# EAGLE design Funky_v3_r3 (EAGLE 6.1)
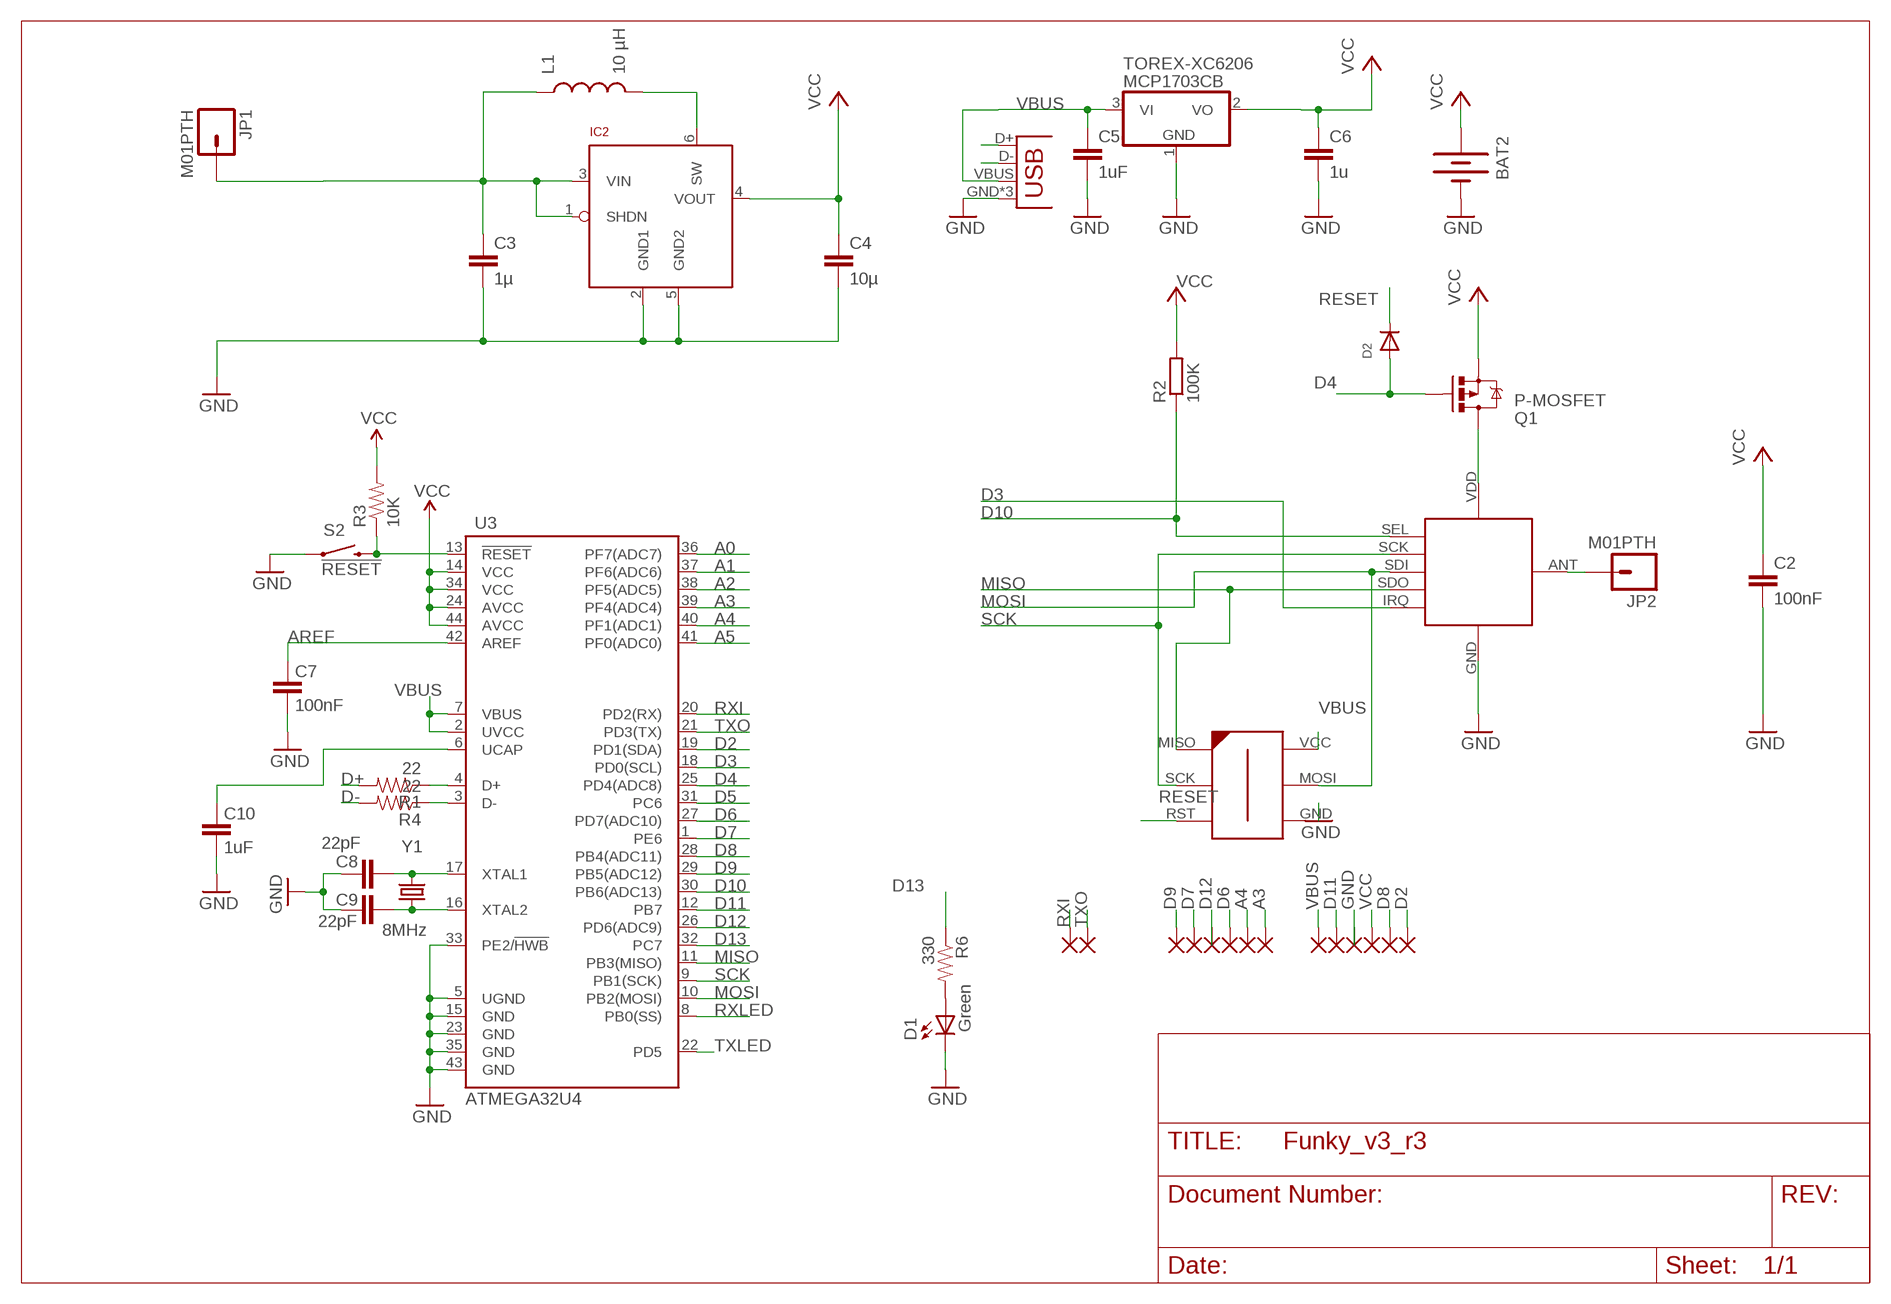
[diagram p0: schematic, sheet 1]

## Parts
BAT2  BATTERY20PTH  [BATTCOM_20MM_PTH]
C2  100nF  C-EUC0603K  [C0603K]
C3  1µ  CAP0603-CAP  [0603-CAP]
C4  10µ  CAP0805  [0805]
C5  1uF  C-EUC0603K  [C0603K]
C6  1u  C-EUC0603K  [C0603K]
C7  100nF  CAP0402-CAP  [0402-CAP]
C8  22pF  CAP0402-CAP  [0402-CAP]
C9  22pF  CAP0402-CAP  [0402-CAP]
C10  1uF  CAP0402-CAP  [0402-CAP]
D1  Green  LED0603  [LED-0603]
D2  DIODESOD-323F  [SOD-323F]
IC2  LTC3525  [SC70]
JP1  M01PTH  [1X01]
JP2  M01PTH  [1X01]
JP3  USB-MICROB  [USB-MICROB]
L1  10 µH  INDUCTOR1210  [1210]
PAD1  SMD2  [SMD1,27-2,54]
PAD2  SMD2  [SMD1,27-2,54]
PAD3  SMD2  [SMD1,27-2,54]
PAD4  SMD2  [SMD1,27-2,54]
PAD5  SMD2  [SMD1,27-2,54]
PAD6  SMD2  [SMD1,27-2,54]
PAD7  SMD2  [SMD1,27-2,54]
PAD8  SMD2  [SMD1,27-2,54]
PAD9  SMD2  [SMD1,27-2,54]
PAD10  SMD2  [SMD1,27-2,54]
PAD11  SMD2  [SMD1,27-2,54]
PAD12  SMD2  [SMD1,27-2,54]
PAD13  SMD2  [SMD1,27-2,54]
PAD14  SMD2  [SMD1,27-2,54]
Q1  P-MOSFET  MOSFET-PCHANNEL  [SOT23]
R1  22  RESISTOR0402-RES  [0402-RES]
R2  100K  R-EU_R0402  [R0402]
R3  10K  RESISTOR0402-RES  [0402-RES]
R4  22  RESISTOR0402-RES  [0402-RES]
R6  330  RESISTOR0402-RES  [0402-RES]
RFM12B1  RFM12B_MINPADS  [RFM12B-MINPADS]
S2  !RESET  SWITCH-MOMENTARY-2SMD  [TACTILE_SWITCH_SMD]
TOREX-XC6206  MCP1703CB  [SOT23]
U3  ATMEGA32U4  ATMEGA32U4QFN2  [QFN-44-NOPAD]
U$2  AVR-ISP-6-EDGE  [6PAD_ISP]
Y1  8MHz  CRYSTAL5X3  [CRYSTAL-SMD-5X3]

## Nets
A0: U3.36(PF7(ADC7))
A1: U3.37(PF6(ADC6))
A2: U3.38(PF5(ADC5))
A3: PAD6.1(P) U3.39(PF4(ADC4))
A4: PAD5.1(P) U3.40(PF1(ADC1))
A5: U3.41(PF0(ADC0))
AREF: C7.2 U3.42(AREF)
D2: PAD12.1(P) U3.19(PD1(SDA))
D3: RFM12B1.IRQ U3.18(PD0(SCL))
D4: D2.A Q1.1(G) U3.25(PD4(ADC8))
D5: U3.31(PC6)
D6: PAD4.1(P) U3.27(PD7(ADC10))
D7: PAD2.1(P) U3.1(PE6)
D8: PAD11.1(P) U3.28(PB4(ADC11))
D9: PAD1.1(P) U3.29(PB5(ADC12))
D10: R2.1 RFM12B1.SEL U3.30(PB6(ADC13))
D11: PAD7.1(P) U3.12(PB7)
D12: PAD3.1(P) U3.26(PD6(ADC9))
D13: R6.1 U3.32(PC7)
D+: JP3.D+ R1.2
D-: JP3.D- R4.2
GND [power]: BAT2.2(-) C2.2 C3.2 C4.2 C5.2 C6.2 C7.1 C8.2 C9.2 C10.1 D1.C IC2.2(GND1) IC2.5(GND2) JP3.GND JP3.MT1(GND) JP3.MT2(GND) PAD9.1(P) RFM12B1.GND S2.1 TOREX-XC6206.1(GND) U3.5(UGND) U3.15(GND) U3.23(GND) U3.33(PE2/!HWB) U3.35(GND) U3.43(GND) U$2.GND
MISO: RFM12B1.SDO(SDO/MISO) U3.11(PB3(MISO)) U$2.MISO
MOSI: RFM12B1.SDI(SDI/MOSI) U3.10(PB2(MOSI)) U$2.MOSI
N$1: C9.1 U3.16(XTAL2) Y1.1
N$2: R1.1 U3.4(D+)
N$3: JP2.1 RFM12B1.ANT
N$4: C8.1 U3.17(XTAL1) Y1.3
N$5: C10.2 U3.6(UCAP)
N$6: D1.A R6.2
N$7: R4.1 U3.3(D-)
N$10: Q1.3(D) RFM12B1.VDD
N$13 [power]: IC2.6(SW) L1.2
RESET: D2.C R3.1 S2.3 U3.13(!RESET) U$2.RST
RXI: PAD14.1(P) U3.20(PD2(RX))
RXLED: U3.8(PB0(SS))
SCK: RFM12B1.SCK U3.9(PB1(SCK)) U$2.SCK
TXLED: U3.22(PD5)
TXO: PAD13.1(P) U3.21(PD3(TX))
VBUS [power]: C5.1 JP3.VBUS PAD8.1(P) TOREX-XC6206.3(VI) U3.2(UVCC) U3.7(VBUS) U$2.VCC
VCC [power]: BAT2.1(+) C2.1 C4.1 C6.1 IC2.4(VOUT) PAD10.1(P) Q1.2(S) R2.2 R3.2 TOREX-XC6206.2(VO) U3.14(VCC) U3.24(AVCC) U3.34(VCC) U3.44(AVCC)
VIN [power]: C3.1 IC2.1(SHDN) IC2.3(VIN) JP1.1 L1.1

## Library data of the parts
BAT2 = SparkFun:BATTERY: Battery Holders Various common sizes : AA, AAA, 20mm coin cell and 12mm coin cell.
C2 C5 C6 = rcl:C-EU: CAPACITOR, European symbol
C3 C4 C7-C10 = SparkFun:CAP: Capacitor Standard 0603 ceramic capacitor, and 0.1" leaded capacitor.
D1 = SparkFun:LED: LEDs Standard schematic elements and footprints for 5mm, 3mm, 1206, and 0603 sized LEDs. 5mm - Spark Fun Electronics SKU : COM-00529 (and others)
D2 = adafruit:DIODE: Diode SMADIODE - SMA Surface Mount Package 20V 1A Schottky Diode Digikey: 641-1014-6-ND DO-1N4148 - Through Hole Small Current Diode SOD-123 20V 1 A (.5mV Vf) Schottky Diode - Digikey: MBRX120TPMSCT-ND SOD-323 10V 570mA (.38mV Vf, 3ns) Schottky Diode - Digikey: ZLLS410CT-ND SOD-523 30V 30mA Schottky Diode (RB751S-40TE61) - Digikey: RB751S-40TE61CT-ND SOT23-R/W - SOT23 Package (R = Solder Paste/Reflow Ovens, W = Hand-Soldering) BAT54Film 40V 300mA - Digikey: 497-7162-1-ND
IC2 = JeeLabs:LTC3525
JP1 JP2 = SparkFun:M01: Header 1 Standard 1-pin 0.1" header. Use with straight break away headers (SKU : PRT-00116), right angle break away headers (PRT-00553), swiss pins (PRT-00743), machine pins (PRT-00117), and female headers (PRT-00115).
JP3 = SparkFun-Connectors:USB: USB Connectors USB-B-PTH is fully proven SKU : PRT-00139/CONN-08278 USB-miniB is fully proven SKU : PRT-00587 USB-A-PCB is untested. USB-A-H is throughly reviewed, but untested. Spark Fun Electronics SKU : PRT-00437 USB-B-SMT is throughly reviewed, but untested. Needs silkscreen touching up. USB-A-S has not been used/tested USB-MB-H has not been used/tested USB-MICROB has been used. CONN-09505; PROD_ID: CONN-09505
L1 = SparkFun:INDUCTOR: Inductors Basic Inductor/Choke - 0603 and 1206. Footprints are not proven and vary greatly between part numbers.
PAD1-PAD14 = wirepad:SMD2: SMD PAD
Q1 = SparkFun:MOSFET-PCHANNEL
R1 R3 R4 R6 = SparkFun:RESISTOR: Resistor Basic schematic elements and footprints for 0603, 1206, and PTH resistors.
R2 = resistor:R-EU_: RESISTOR, European symbol
RFM12B1 = LowPowerLab:RFM12B_MINPADS
S2 = SparkFun-Electromechanical:SWITCH-MOMENTARY-2: Various NO switches- pushbuttons, reed, etc; PROD_ID: SWCH-08247
TOREX-XC6206 = linear:MCP1703: 250 mA, 16V, Low Quiescent Current LDO Regulator Source: http://ww1.microchip.com/downloads/en/DeviceDoc/22049b.pdf
U3 = SparkFun:ATMEGA32U4
U$2 = avr-7:AVR-ISP-6-EDGE: 6 pin edge connector for ISP with ATMEL MCUs. Developed by Craig Moates (craig at moates dot net). Library by David Blundell (blundar at gmail dot com). Often, even a 6 pin header is really inconvenient for board layout and/or production. This SMD-only header is our de-facto standard for using an edge connector for programming with the help of a 6pin/10pin to edge card adapter.
Y1 = SparkFun:CRYSTAL: Crystals Various standard crystals. Proven footprints. Spark Fun Electronics SKU : COM-00534

## Net classes
1 power: width 0.254 mm, clearance 0.203 mm

## Board
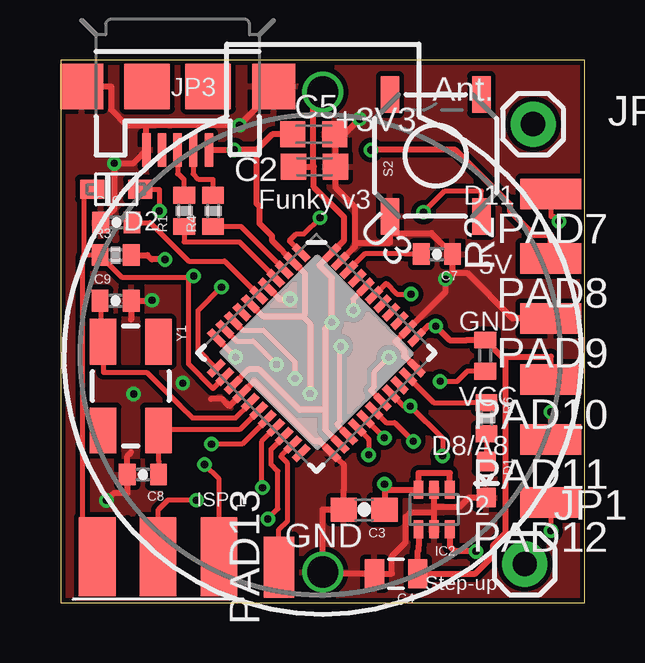
[diagram p1: board, top side]
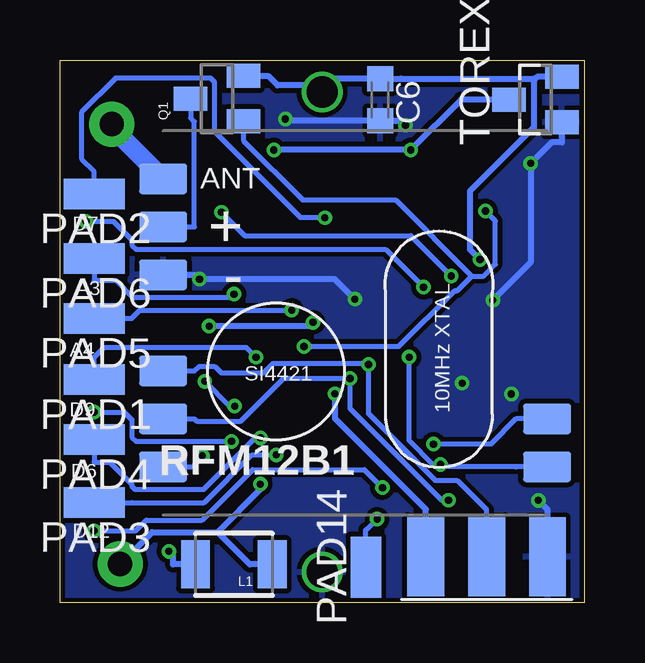
[diagram p2: board, bottom side, seen from below]

Size 21.84 x 22.61 mm. Coordinates in mm from the lower left corner, seen from the top.
Outline: 0,0 21.84,0 21.84,22.61 0,22.61 0,0
Copper layers (1*16): Top 0.035mm / dielectric 1.5mm / Bottom 0.035mm
Design rules: minimum track width 0.2mm, minimum drill 0.3mm, track to track 0.2mm, track to pad 0.2mm, pad to pad 0.2mm, via to via 0.2mm, smd to smd 0.2mm, copper to edge 0.2mm, drill to drill 0.2mm, minimum pad ring 0.2mm, minimum via ring 0.15mm, stop-mask expansion 0.075mm, vias tented up to drill 0.3mm, thermal gap 0.2mm
tRestrict: 2 lines
bRestrict: 2 lines

### Footprints (pad centres in the part's own frame; a part is rotated, then mirrored left to right if it is on the bottom)
BATTCOM_20MM_PTH = drill 1.3: 1 20,0; 2 0,0
C0603K = smd 1.05 x 1.08: 1 -0.875,0; 2 0.875,0
0603-CAP = smd 1.1 x 1: 1 -0.85,0; 2 0.85,0
0805 = smd 0.8 x 1.2: 1 -0.9,0; 2 0.9,0
0402-CAP = smd 0.7 x 0.9: 1 -0.65,0; 2 0.65,0
LED-0603 = smd 0.8 x 0.8: A 0,-0.75; C 0,0.75
SOD-323F = smd 1 x 0.8: A -1,0; C 1,0
SC70 = smd 0.4 x 0.75: 1 -0.65,-0.825; 2 0,-0.825; 3 0.65,-0.825; 4 0.65,0.825; 5 0,0.825; 6 -0.65,0.825
1X01 = drill 1.016 pad 1.88: 1 0,0
USB-MICROB = smd 0.35 x 1.4: D+ 0,2.65; D- -0.65,2.65; GND 1.3,2.65; ID 0.65,2.65; VBUS -1.3,2.65 | smd 1.8 x 1.9: MT1 -4,0; MT2 4,0 | smd 1.9 x 1.9: P$1 -1.27,0; P$2 1.27,0
1210 = smd 1.2 x 2: 1 -1.6,0; 2 1.6,0
SMD1,27-2,54 = smd 1.27 x 2.54: 1 0,0
SOT23 = smd 1 x 1.4: 1 -0.95,-1.1; 2 0.95,-1.1; 3 0,1.1
0402-RES = smd 0.7 x 0.9: 1 -0.65,0; 2 0.65,0
R0402 = smd 0.7 x 0.9: 1 -0.65,0; 2 0.65,0
RFM12B-MINPADS = smd 2 x 1.27: ANT 8,-6; GND 8,-2; IRQ -8,4; SCK 8,4; SDI 8,2; SDO -8,6; SEL 8,6; VDD 8,-4
TACTILE_SWITCH_SMD = smd 1.524 x 0.762: 1 -2.54,1.905; 2 2.54,1.905; 3 -2.54,-1.905; 4 2.54,-1.905
QFN-44-NOPAD = smd 0.8 x 0.3: 1 -3.4,2.5; 2 -3.4,2; 3 -3.4,1.5; 4 -3.4,1; 5 -3.4,0.5; 6 -3.4,0; 7 -3.4,-0.5; 8 -3.4,-1; 9 -3.4,-1.5; 10 -3.4,-2; 11 -3.4,-2.5; 23 3.4,-2.5; 24 3.4,-2; 25 3.4,-1.5; 26 3.4,-1; 27 3.4,-0.5; 28 3.4,0; 29 3.4,0.5; 30 3.4,1; 31 3.4,1.5; 32 3.4,2; 33 3.4,2.5 | smd 0.3 x 0.8: 12 -2.5,-3.4; 13 -2,-3.4; 14 -1.5,-3.4; 15 -1,-3.4; 16 -0.5,-3.4; 17 0,-3.4; 18 0.5,-3.4; 19 1,-3.4; 20 1.5,-3.4; 21 2,-3.4; 22 2.5,-3.4; 34 2.5,3.4; 35 2,3.4; 36 1.5,3.4; 37 1,3.4; 38 0.5,3.4; 39 0,3.4; 40 -0.5,3.4; 41 -1,3.4; 42 -1.5,3.4; 43 -2,3.4; 44 -2.5,3.4
6PAD_ISP = smd 1.524 x 3.302 bottom: GND 2.54,0; MOSI 0,0; VCC -2.54,0 | smd 1.524 x 3.302: MISO -2.54,0; RST 2.54,0; SCK 0,0
CRYSTAL-SMD-5X3 = smd 1.9 x 1.1: 1 -1.85,-1.15; 2 1.85,-1.15; 3 1.85,1.15; 4 -1.85,1.15

### Placement (x,y rotation side)
BAT2  10.92,1.27 90 top
C2  10.57,18.16 0 top
C3  12.64,3.87 180 top
C4  13.97,1.21 180 top
C5  10.54,19.51 0 top
C6  8.51,20.96 270 bottom
C7  15.67,14.52 180 top
C8  3.43,5.33 180 top
C9  2.29,12.57 0 top
C10  2.32,15.84 0 top
D1  17.74,5.12 180 top
D2  2.31,17.22 180 top
IC2  15.56,3.88 180 top
JP1  19.34,1.6 0 top
JP2  19.69,19.94 0 top
JP3  4.87,21.51 180 top
L1  14.6,1.59 180 bottom
PAD1  20.42,9.28 90 bottom
PAD2  20.42,17.03 90 bottom
PAD3  20.42,4.16 90 bottom
PAD4  20.42,6.79 90 bottom
PAD5  20.42,11.84 90 bottom
PAD6  20.42,14.34 90 bottom
PAD7  20.42,17.03 90 top
PAD8  20.42,14.34 90 top
PAD9  20.42,11.84 90 top
PAD10  20.42,9.28 90 top
PAD11  20.42,6.79 90 top
PAD12  20.42,4.16 90 top
PAD13  9.1,1.48 0 top
PAD14  9.1,1.48 0 bottom
Q1  15.3,21 90 bottom
R1  5.15,16.32 90 top
R2  17.69,10.29 90 top
R3  2.29,14.48 0 top
R4  6.35,16.32 90 top
R6  17.74,7.68 270 top
RFM12B1  9.54,11.65 180 bottom
S2  15.62,18.63 90 top
TOREX-XC6206  2.03,20.96 90 bottom
U3  10.66,10.4 315 top
U$2  4.06,1.9 180 top
Y1  2.92,9.02 270 top

### Tracks (layer width: path | path; a pad name or v marks a point on that pad's centre or on a via)
A3  (via drill 0.3 pad 0.6)
  Top 0.2: U3.39 13.08,12.79 U3.39 | U3.39 13.56,13.3 14.01,12.85 v14.6,12.85
  Bottom 0.2: PAD6.1 20.42,13.41 19.49,13.41 18.78,12.7 14.75,12.7 v14.6,12.85
A4  (via drill 0.3 pad 0.6)
  Top 0.2: U3.40 12.19,12.64 v12.19,12.18 | U3.40 12.78,13.19 U3.40
  Bottom 0.2: PAD5.1 18.85,11.84 18.52,12.18 v12.19,12.18
AREF
  Top 0.2: 12.06,13.92 12.66,14.53 14.36,14.53 14.37,14.52 C7.2 | 12.06,13.92 U3.42 12.08,13.89 12.06,13.92
D2  (via drill 0.3 pad 0.6)
  Top 0.2: U3.19 8.37,6.7 8.37,4.83 v8.41,4.79 | v20.42,2.99 20.42,3.23 PAD12.1 | U3.19 8.98,7.29 U3.19
  Bottom 0.2: v20.42,2.99 18.68,2.99 18.24,3.43 15.93,3.43 13.82,5.54 9.16,5.54 v8.41,4.79
D3  (via drill 0.3 pad 0.6)
  Top 0.2: U3.18 | U3.18 7.57,6.6 v6.29,6.6 | U3.18 8.68,7.69 U3.18
  Bottom 0.2: RFM12B1.IRQ 2.84,7.65 3.89,6.6 v6.29,6.6
D4  (via drill 0.3 pad 0.6)
  Top 0.2: 11.96,6.97 U3.25 11.98,6.99 11.96,6.97 | 11.96,6.97 11.51,7.43 11.63,7.56 11.63,10.63 v11.67,10.67 | v4.11,16.31 4.11,17.22 D2.A
  Bottom 0.2: 4.69,13.61 4.19,13.61 3.7,14.09 3.7,15.9 v4.11,16.31 | 4.69,13.61 7.86,16.78 11.74,16.78 14.2,19.25 Q1.1 | v11.67,10.67 7.72,10.67 5.39,13 5.29,13 4.69,13.61
D6  (via drill 0.3 pad 0.6)
  Top 0.2: U3.27 v13.49,6.86 | U3.27 12.68,7.69 U3.27 | U3.27
  Bottom 0.2: v13.49,6.86 13.7,6.86 15.85,4.72 18.73,4.72 18.85,4.84 18.85,4.93 19.77,5.85 20.42,5.85 PAD4.1
D7  (via drill 0.3 pad 0.6)
  Top 0.2: U3.1 9.53,15.07 9.82,15.36 10.13,15.36 v10.81,16.04 | U3.1 10.08,14.59 U3.1
  Bottom 0.2: PAD2.1 20.42,17.96 20.96,18.5 20.96,20.42 19.53,21.85 15.57,21.85 15.4,21.68 15.4,19.62 11.82,16.04 v10.81,16.04
D8  (via drill 0.3 pad 0.6)
  Top 0.2: v14.7,6.72 13.91,7.5 13.56,7.5 U3.28 | U3.28 13.08,7.99 U3.28 | PAD11.1 v20.42,7.94
  Bottom 0.2: v20.42,7.94 19.16,7.94 18.84,7.62 18.84,6.89 18.67,6.72 v14.7,6.72
D9  (via drill 0.3 pad 0.6)
  Top 0.2: 13.38,8.39 U3.29 13.38,8.39 | 13.38,8.39 12.92,8.84 13.07,8.99 13.07,9.61 v13.68,10.22
  Bottom 0.2: PAD1.1 20.42,10.22 20.02,10.63 14.08,10.63 v13.68,10.22
D10  (via drill 0.3 pad 0.6)
  Top 0.2: v15.91,6.11 15.91,6.84 v14.57,8.18 14.29,8.18 13.78,8.69 | 13.78,8.69 U3.30 13.78,8.69 | v15.81,9.22 16.52,9.22 16.94,9.64 R2.1
  Bottom 0.2: RFM12B1.SEL 16.24,5.65 16.24,5.78 v15.91,6.11 | v15.81,9.22 14.78,8.18 v14.57,8.18
D11  (via drill 0.3 pad 0.6)
  Top 0.2: U3.12 5.72,10.53 5.72,12.17 v6.7,13.14 | v20.76,15.89 20.55,16.09 20.42,16.09 PAD7.1 | U3.12 6.58,9.79 U3.12
  Bottom 0.2: v20.76,15.89 19.62,15.89 18.85,15.11 18.85,14.9 18.67,14.72 8.27,14.72 v6.7,13.14
D12  (via drill 0.3 pad 0.6)
  Top 0.2: 12.37,7.28 U3.26 12.38,7.29 12.37,7.28 | 12.37,7.28 12.85,6.79 12.83,6.78 v12.83,6.15
  Bottom 0.2: v12.83,6.15 13.85,6.15 15.83,4.16 18.85,4.16 PAD3.1
D13
  Top 0.2: 14.49,9.4 U3.32 14.48,9.39 14.49,9.4 | 14.49,9.4 15.55,8.33 16.99,8.33 R6.1
D+
  Top 0.2: JP3.D+ 4.87,17.86 4.91,17.86 5.15,17.62 R1.2
D-
  Top 0.2: JP3.D- 5.52,17.86 5.76,17.62 6.35,17.62 R4.2
GND  (via drill 0.3 pad 0.6)
  Top 0.254: U3.5 9.12,12.64 v9.56,12.64 | 16.32,13.74 16.06,13.47 v16.03,13.47 16.03,12.95 U3.35 | U3.33 14.31,10.28 14.31,10.52 13.96,10.87 14.38,11.3 | U3.35 14.38,11.3 | JP3.MT2 2.1,21.51 2.1,20.55 2.76,19.89 3.57,19.89 | C10.1 2.23,16.4 v2.23,18.3 3.01,18.3 JP3.GND 3.57,19.89 | 3.57,19.89 v7.45,19.89 8.87,21.31 JP3.MT1 | 2.94,6.27 2.78,6.11 C8.2 2.78,4.94 2.78,4.55 2.21,4.55 v1.91,4.26 | 6.26,8.48 6.71,8.48 6.91,8.29 6.93,8.29 7.03,8.19 U3.15 | 16.32,13.74 16.93,13.74 18.82,11.84 PAD9.1 | v3.81,12.6 3.64,12.6 3.62,12.57 C9.2 2.94,11.79 | D1.C 17.01,4.37 16.62,3.99 15.56,3.99 | 15.56,3.99 IC2.2 | 15.56,3.76 15.56,3.99 | 15.56,3.76 14.57,3.76 14.38,3.56 14.38,2.51 13.8,1.94 13.8,1.21 C4.2 10.99,1.21 BAT2.2 10.91,3.87 C3.2 11.79,4.7 11.81,4.71 11.81,5.71 11.55,5.97 U3.23 | IC2.5 15.56,3.76 | 13.72,15.39 15.45,15.39 C7.1 16.32,13.74 | 13.72,15.39 13.72,15 12.27,15 | S2.1 13.72,15.39 | 12.27,15 12.27,16.48 11.45,17.29 C2.2 11.45,19.34 11.62,19.51 | 12.27,15 12.27,14.84 12.1,14.67 U3.43 | 11.62,19.51 11.81,19.51 v12.46,20.15 | C5.2 11.62,19.51 | U3.23 10.78,6.75 10.54,6.75 8.06,9.22 U3.15 | U3.23 11.28,6.19 U3.23 | 14.38,11.3 14.38,11.29 U3.35 | U3.5 8.58,13.19 U3.5 | U3.33 14.88,9.79 U3.33 | U3.15 | U3.43
  Bottom 0.254: v9.56,12.64 10.4,13.48 v16.03,13.48 v16.03,13.47 16.21,13.65 RFM12B1.GND | v3.81,12.6 2.23,14.17 v2.23,18.3 1.36,19.18 0.93,19.18 TOREX-XC6206.1 | v7.45,19.89 7.64,20.08 C6.2 8.77,20.08 9.38,20.08 12.39,20.08 v12.46,20.15 | U$2.GND 1.52,3.89 1.54,3.89 v1.91,4.26
  other vias: 5.09,9.14 3.04,8.69
  pour Top: -0.7,23.17 -0.7,-0.7 22.22,-0.7 22.22,23.17
  pour Bottom: -1.4,23.94 -1.4,-1.34 22.92,-1.34 22.92,24.13 -1.34,24.13
MISO  (via drill 0.3 pad 0.6)
  Top 0.2: v5.99,5.75 6.6,5.14 6.6,3.86 U$2.MISO | U3.11 v7.3,10.23 | U3.11 6.48,11.09 U3.11
  Bottom 0.2: v7.3,10.23 7.3,6.75 6.3,5.75 v5.99,5.75 5.89,5.65 2.84,5.65 RFM12B1.SDO
MOSI  (via drill 0.3 pad 0.6)
  Top 0.2: v8.99,9.92 8.02,10.89 7.33,10.89 6.86,11.37 | 6.86,11.37 U3.10 6.88,11.39 6.86,11.37
  Bottom 0.2: U$2.MOSI 4.06,3.86 5.3,5.09 6.2,5.09 8.99,7.88 v8.99,9.92 9.04,9.97 12.96,9.97 13.36,9.56 15.12,9.56 15.4,9.84 16.05,9.84 16.24,9.65 RFM12B1.SDI
N$1
  Top 0.2: U3.16 | U3.16 7.98,8.39 U3.16 | U3.16 | U3.16 7.88,8.29 7.28,7.69 5.5,7.69 4.98,8.19 3.58,9.59 1.78,9.59 1.78,10.79 Y1.1 1.68,10.89 1.68,12.49 C9.1
N$2
  Top 0.2: R1.1 5.15,15.02 7.45,15.02 8.88,13.59 | 8.88,13.59 U3.4 8.88,13.59
N$3
  Bottom 0.813: RFM12B1.ANT 19.69,19.79 JP2.1
N$4
  Top 0.2: U3.17 7.48,7.23 4.13,7.23 Y1.3 4.07,7.06 4.07,5.92 4.08,5.91 C8.1 | U3.17 8.28,7.99 U3.17
N$5
  Top 0.2: C10.2 3.73,15.84 5.34,14.22 6.83,14.22 8.18,12.88 | 8.18,12.88 U3.6 8.18,12.89 8.18,12.88
N$6
  Top 0.2: R6.2 17.74,6.38 17.74,6.37 D1.A
N$7
  Top 0.2: R4.1 7.51,15.67 9.29,13.89 | 9.29,13.89 U3.3 9.28,13.89 9.29,13.89
N$10
  Bottom 0.2: RFM12B1.VDD 16.24,15.65 16.24,20.04 16.4,20.2 Q1.3
N$13  (via drill 0.3 pad 0.6)
  Top 0.254: IC2.6 16.21,2.35 16.43,2.13 v17.31,2.13
  Bottom 0.254: L1.2 17.13,1.59 17.13,1.95 v17.31,2.13
RESET  (via drill 0.3 pad 0.6)
  Top 0.2: 5.32,13.56 5.5,13.56 v5.54,13.6 | 5.32,13.56 2.56,13.56 R3.1 0.99,14.48 | 5.32,13.56 5.32,9.94 6.34,8.91 U3.13 | S2.3 17.53,17.15 16.01,17.15 v15.12,16.26 | U$2.RST 0.92,2.51 0.92,14.41 0.99,14.48 | 0.99,14.48 0.99,16.89 D2.C | U3.13 6.88,9.49 U3.13
  Bottom 0.2: v15.12,16.26 14.15,15.29 7.23,15.29 v5.54,13.6
RXI  (via drill 0.3 pad 0.6)
  Top 0.2: v8.63,3.48 9.05,3.9 9.05,5.47 8.77,5.76 8.77,6.39 U3.20 | U3.20 9.38,6.99 U3.20
  Bottom 0.2: v8.63,3.48 9.06,3.05 9.1,3.05 PAD14.1
SCK  (via drill 0.3 pad 0.6)
  Top 0.2: U$2.SCK 4.06,3.86 4.47,4.26 v5.66,4.26 | U3.9 7.58,11.35 8.45,11.35 9.76,10.04 v9.76,9.34 | U3.9 7.18,11.79 U3.9
  Bottom 0.2: v5.66,4.26 5.94,4.26 9.76,8.09 v9.76,9.34 12.53,9.34 14.3,7.56 16.15,7.56 16.24,7.65 RFM12B1.SCK
TXO
  Top 0.2: PAD13.1 9.1,3.05 9.45,3.4 9.45,5.8 9.17,6.09 U3.21 | U3.21 9.68,6.59 U3.21
VBUS  (via drill 0.3 pad 0.6)
  Top 0.254: 10.08,11.93 10.19,12.04 10.19,13.7 10.18,13.7 9.69,14.2 | 10.08,11.93 10.39,11.62 v10.39,8.7 | v12.93,18.86 16.45,18.86 18.72,16.58 18.72,16.31 19.73,15.3 20.42,15.3 PAD8.1 | 8.16,18.86 v7.23,18.86 JP3.VBUS | 8.16,18.86 8.81,19.51 C5.1 | 8.16,18.86 8.16,16.62 8.29,16.49 8.29,15.79 8.81,15.27 8.81,15.08 9.15,14.73 9.41,14.48 U3.2 | 10.08,11.93 8.42,11.93 U3.7 | U3.2 9.69,14.2 | U3.7 7.88,12.49 U3.7 | 9.69,14.2 9.68,14.19 U3.2
  Bottom 0.254: v10.39,8.7 10.39,7.67 6.6,3.89 U$2.VCC | v12.93,18.86 v7.23,18.86 5.13,20.96 TOREX-XC6206.3
VCC  (via drill 0.3 pad 0.6)
  Top 0.254: 11.02,8.03 11.02,7.21 U3.24 | 11.02,8.03 11.02,11.4 v11.3,11.68 11.3,13.53 10.78,14.05 U3.44 | 11.02,8.03 9.96,8.03 8.28,9.71 7.85,9.71 U3.14 | R3.2 3.62,14.48 3.8,14.3 v4.35,14.3 | 10.52,18.16 10.52,20.87 BAT2.1 | 10.52,18.16 10.55,18.16 10.55,17.31 11.81,16.05 11.81,15.09 U3.44 | 10.52,18.16 10.43,18.16 C2.1 | 18.55,10.25 18.55,2.91 18.01,2.38 18.01,1.94 17.27,1.21 C4.1 14.87,2.14 14.91,2.17 14.91,2.35 IC2.4 | 14.88,11.09 U3.34 14.88,11.09 | 14.88,11.09 15.35,11.55 15.59,11.55 v15.63,11.52 16.21,10.94 16.91,10.94 R2.2 18.38,10.25 18.55,10.25 | 18.55,10.25 20.42,10.25 PAD10.1 | U3.44 11.28,14.59 U3.44 | 14.88,11.09 | U3.24
  Bottom 0.254: v11.3,11.68 11.46,11.52 v15.63,11.52 | 2.1,21.83 2.1,19.8 4.76,17.14 4.76,14.71 v4.35,14.3 | 2.1,21.83 2.04,21.83 1.96,21.91 TOREX-XC6206.2 | 2.1,21.83 7.64,21.83 8.07,21.83 C6.1 10.64,21.83 10.92,21.55 | 10.92,21.55 12.78,21.55 13.17,21.95 Q1.2 | 10.92,21.55 BAT2.1
VIN  (via drill 0.3 pad 0.6)
  Top 0.254: 13.49,4.7 v13.49,4.93 | 13.49,4.7 C3.1 | 13.49,4.7 IC2.3 14.91,5.41 16.21,5.41 IC2.1
  Bottom 0.254: 15.27,2.93 13.49,4.71 v13.49,4.93 | v13.49,4.93 | JP1.1 18.01,2.93 15.27,2.93 | 15.27,2.93 13.93,1.59 L1.1

### Text on the board
tPlace: Ant. | +3V3 | Funky v3 | D11 | 5V | GND | VCC | D8/A8 | ISP 1 | GND | D2 | Step-up
bPlace: D7 | A3 | A4 | D9 | D6 | D12